# EAGLE schematic irisc (EAGLE 9.2.2)

## Sheet 1 of 2
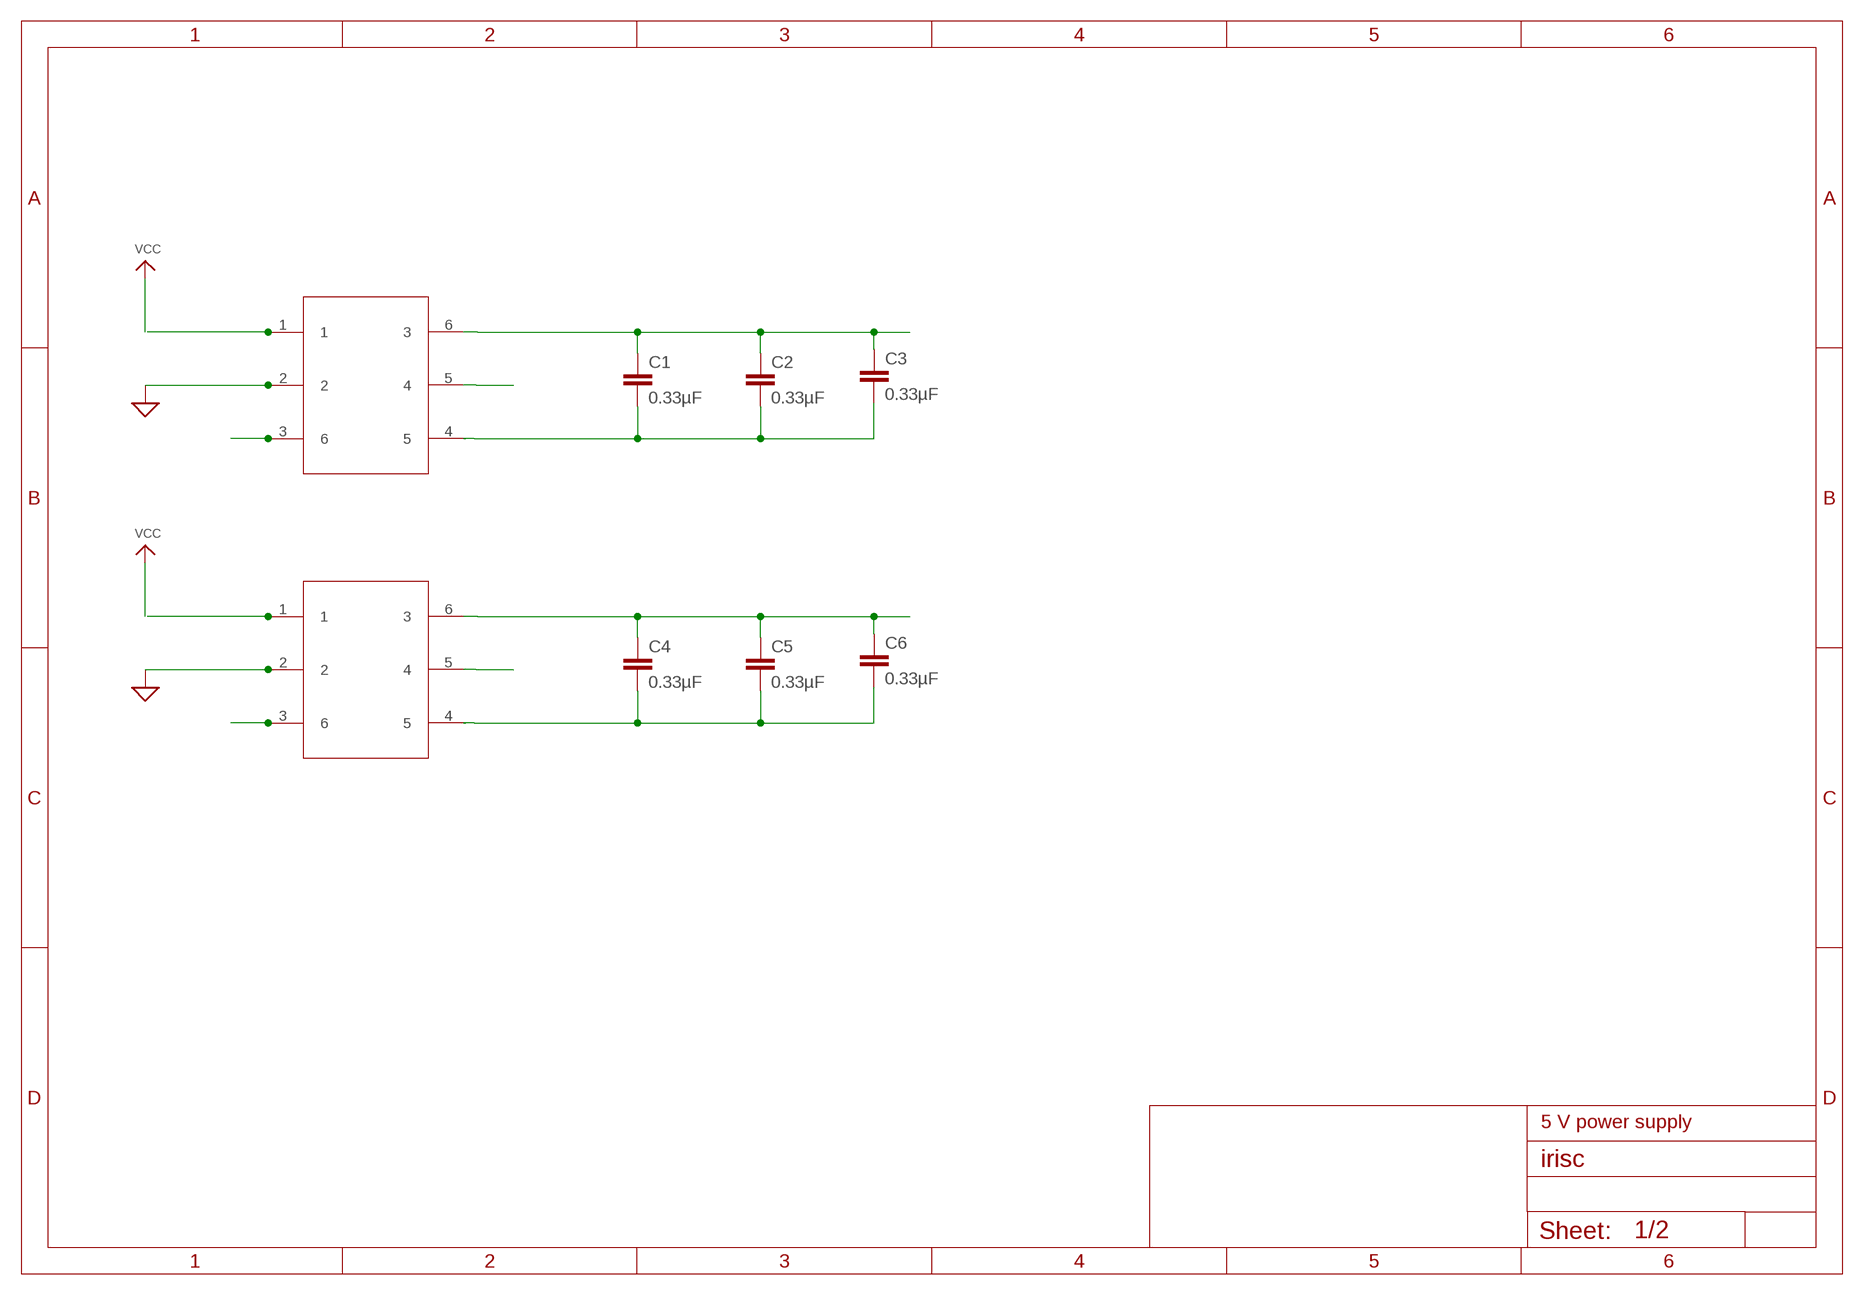
[diagram p0: schematic, sheet 1]

### Parts
C1  0.33µF  0.33UF/330NF-0805-50V-10%  [0805]
C2  0.33µF  0.33UF/330NF-0805-50V-10%  [0805]
C3  0.33µF  0.33UF/330NF-0805-50V-10%  [0805]
C4  0.33µF  0.33UF/330NF-0805-50V-10%  [0805]
C5  0.33µF  0.33UF/330NF-0805-50V-10%  [0805]
C6  0.33µF  0.33UF/330NF-0805-50V-10%  [0805]
U$1  TRACO  [DIP762W50P254L730H410Q6]
U$2  TRACO  [DIP762W50P254L730H410Q6]

### Nets
2: U$1.2 U$2.2 ; supply symbol labelled SUP ; also sheet 2
N$1: U$1.1
N$2: U$1.3
N$3: U$1.5
N$4: C1.1 C2.1 C3.1 U$1.6
N$5: C1.2 C2.2 C3.2
N$6: U$1.4
N$7: C4.1 C5.1 C6.1 U$2.6
N$8: C4.2 C5.2 C6.2
N$9: U$2.1
N$10: U$2.3
N$11: U$2.5
N$12: U$2.4

### Notes on the sheet
- 5 V power supply

## Sheet 2 of 2
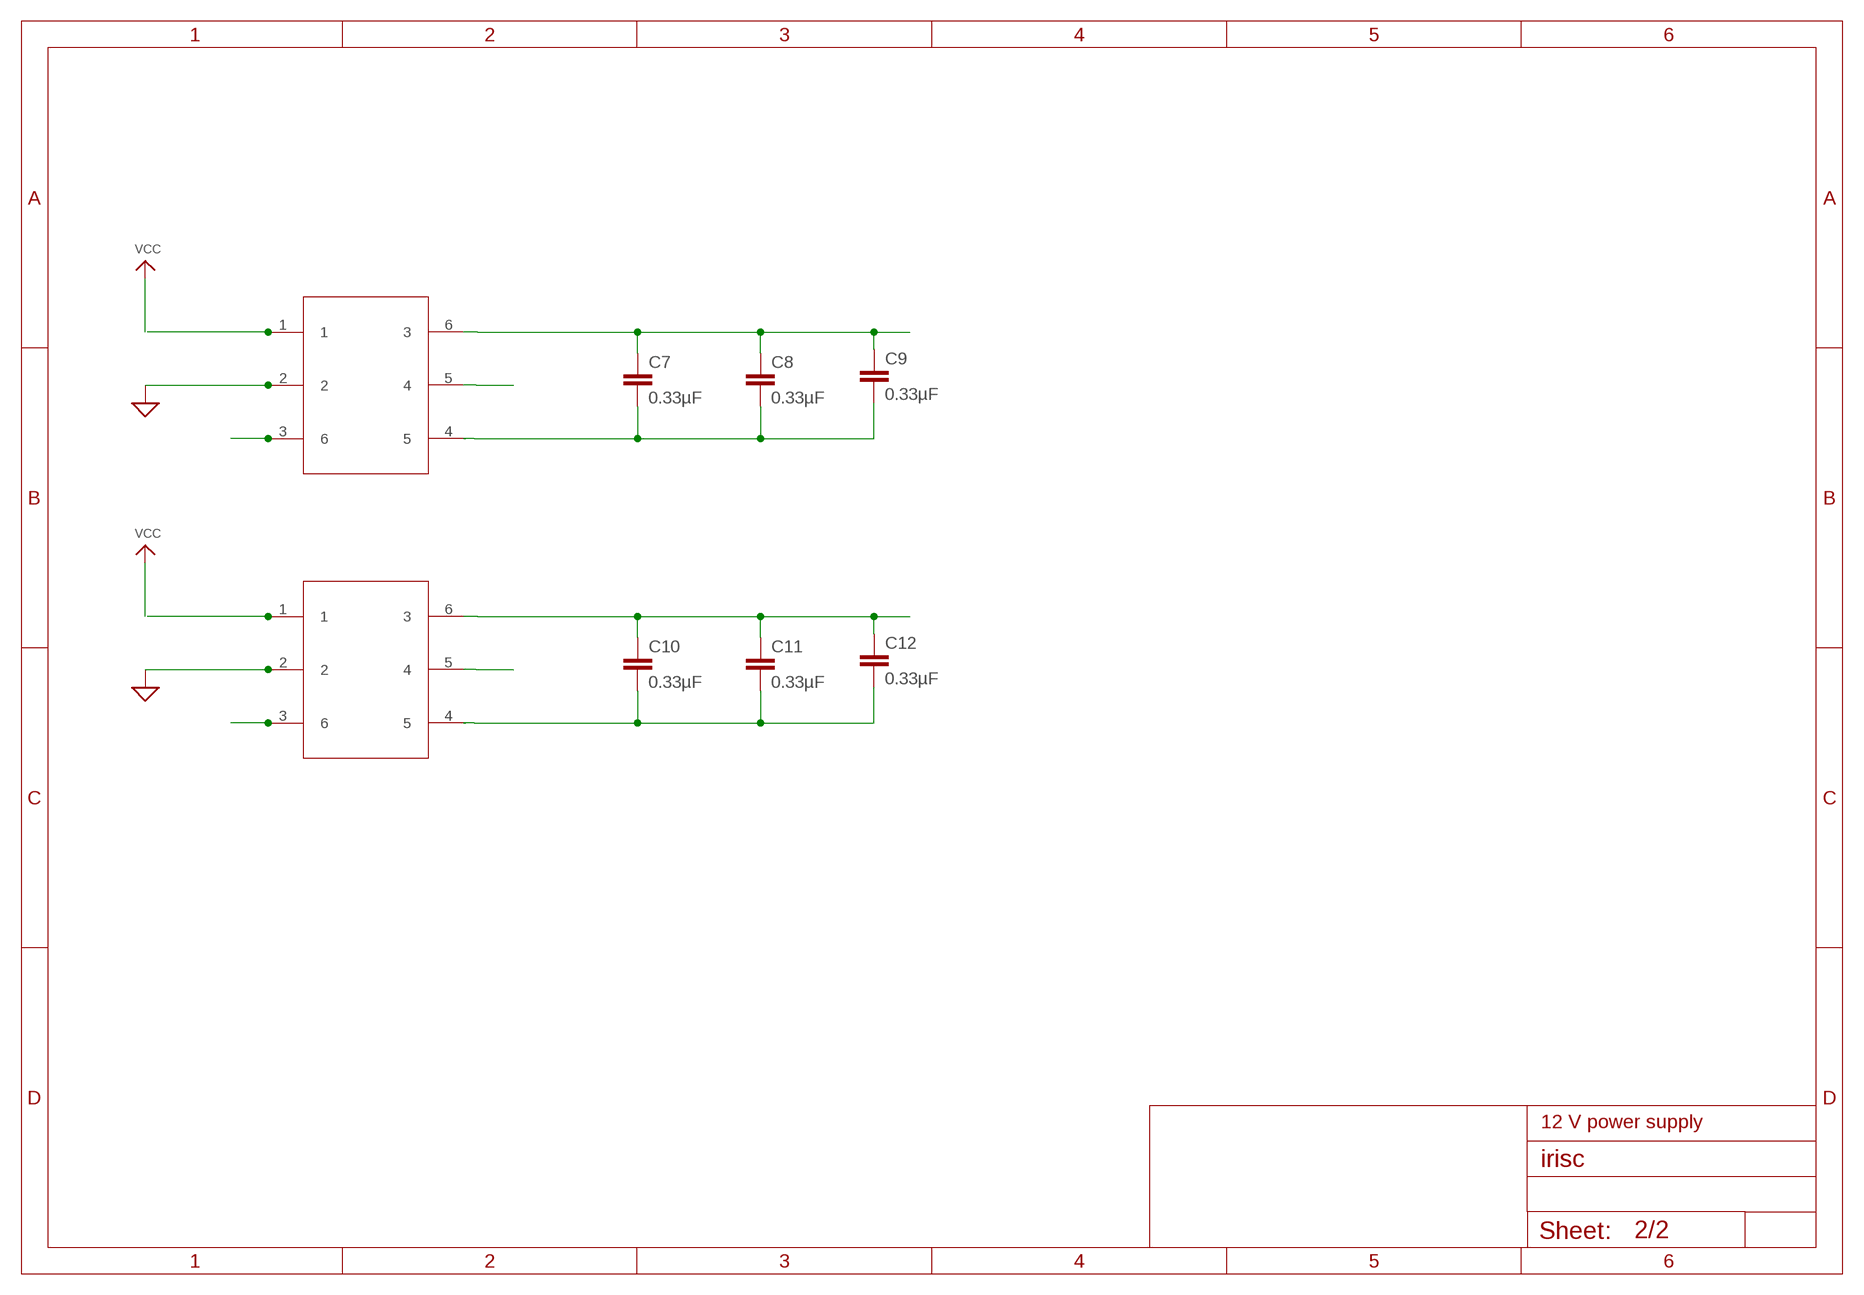
[diagram p1: schematic, sheet 2]

### Parts
C7  0.33µF  0.33UF/330NF-0805-50V-10%  [0805]
C8  0.33µF  0.33UF/330NF-0805-50V-10%  [0805]
C9  0.33µF  0.33UF/330NF-0805-50V-10%  [0805]
C10  0.33µF  0.33UF/330NF-0805-50V-10%  [0805]
C11  0.33µF  0.33UF/330NF-0805-50V-10%  [0805]
C12  0.33µF  0.33UF/330NF-0805-50V-10%  [0805]
U$3  TRACO  [DIP762W50P254L730H410Q6]
U$4  TRACO  [DIP762W50P254L730H410Q6]

### Nets
2: U$3.2 U$4.2 ; supply symbol labelled SUP ; also sheet 1
N$13: C7.1 C8.1 C9.1 U$3.6
N$14: C7.2 C8.2 C9.2
N$15: U$3.1
N$16: U$3.3
N$17: U$3.5
N$18: U$3.4
N$19: C10.1 C11.1 C12.1 U$4.6
N$20: C10.2 C11.2 C12.2
N$21: U$4.1
N$22: U$4.3
N$23: U$4.5
N$24: U$4.4

### Notes on the sheet
- 12 V power supply

## Library data of the parts
C1-C12 = SparkFun-Capacitors:0.33UF/330NF: 0.33µF/330nF ceramic capacitors A capacitor is a passive two-terminal electrical component used to store electrical energy temporarily in an electric field.; PROD_ID: CAP-08469
U$1-U$4 = DIP762W50P254L730H410Q6:TRACO: TRACO : power component used in IRISC